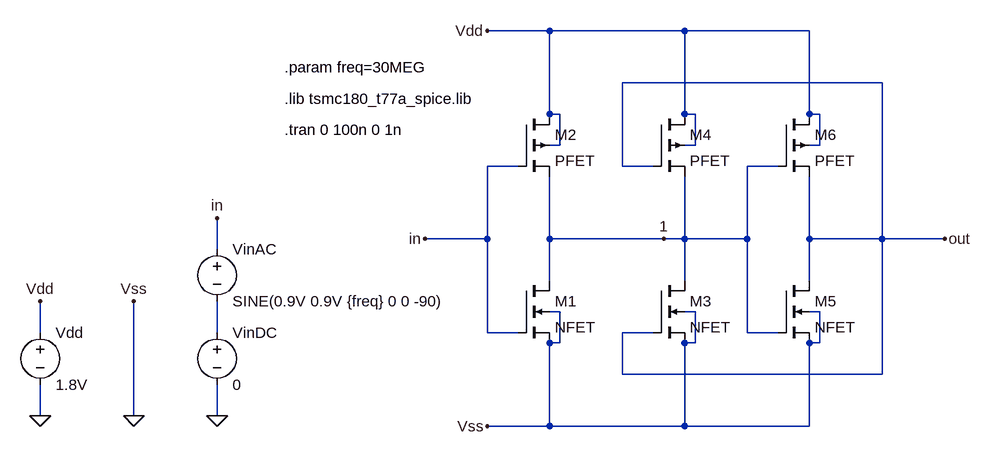
[diagram p0: schematic schmitt_trigger.asc]
schmitt_trigger.asc, the LTspice schematic file:
Version 4.1
SHEET 1 1160 680
WIRE 496 -272 400 -272
WIRE 704 -272 496 -272
WIRE 896 -272 704 -272
WIRE 1008 -192 608 -192
WIRE 496 -144 496 -272
WIRE 512 -144 496 -144
WIRE 704 -144 704 -272
WIRE 720 -144 704 -144
WIRE 896 -144 896 -272
WIRE 912 -144 896 -144
WIRE 512 -96 512 -144
WIRE 512 -96 496 -96
WIRE 720 -96 720 -144
WIRE 720 -96 704 -96
WIRE 912 -96 912 -144
WIRE 912 -96 896 -96
WIRE 448 -64 400 -64
WIRE 608 -64 608 -192
WIRE 656 -64 608 -64
WIRE 848 -64 800 -64
WIRE 400 48 400 -64
WIRE 400 48 304 48
WIRE 496 48 496 -48
WIRE 672 48 496 48
WIRE 704 48 704 -48
WIRE 704 48 672 48
WIRE 800 48 800 -64
WIRE 800 48 704 48
WIRE 896 48 896 -48
WIRE 1008 48 1008 -192
WIRE 1008 48 896 48
WIRE 1104 48 1008 48
WIRE -16 64 -16 16
WIRE 496 112 496 48
WIRE 704 112 704 48
WIRE 896 112 896 48
WIRE 512 160 496 160
WIRE 720 160 704 160
WIRE 912 160 896 160
WIRE -288 192 -288 144
WIRE -16 192 -16 144
WIRE 400 192 400 48
WIRE 448 192 400 192
WIRE 656 192 608 192
WIRE 800 192 800 48
WIRE 848 192 800 192
WIRE 512 208 512 160
WIRE 512 208 496 208
WIRE 720 208 720 160
WIRE 720 208 704 208
WIRE 912 208 912 160
WIRE 912 208 896 208
WIRE 608 256 608 192
WIRE 1008 256 1008 48
WIRE 1008 256 608 256
WIRE -288 320 -288 272
WIRE -144 320 -144 144
WIRE -16 320 -16 272
WIRE 496 336 496 208
WIRE 496 336 400 336
WIRE 704 336 704 208
WIRE 704 336 496 336
WIRE 896 336 896 208
WIRE 896 336 704 336
FLAG 304 48 in
FLAG 1104 48 out
FLAG 400 336 Vss
FLAG 400 -272 Vdd
FLAG -288 320 0
FLAG -288 144 Vdd
FLAG -144 320 0
FLAG -144 144 Vss
FLAG -16 320 0
FLAG -16 16 in
FLAG 672 48 1
SYMBOL nmos4 448 112 R0
SYMATTR InstName M1
SYMATTR Value NFET
SYMATTR Value2 l=.2u w=2u
SYMBOL nmos4 656 112 R0
SYMATTR InstName M3
SYMATTR Value NFET
SYMATTR Value2 l=.2u w=.4u
SYMBOL nmos4 848 112 R0
SYMATTR InstName M5
SYMATTR Value NFET
SYMATTR Value2 l=.2u w=.4u
SYMBOL pmos4 448 -144 R0
SYMATTR InstName M2
SYMATTR Value PFET
SYMATTR Value2 l=.2u w=4u
SYMBOL pmos4 656 -144 R0
SYMATTR InstName M4
SYMATTR Value PFET
SYMATTR Value2 l=.2u w=.8u
SYMBOL pmos4 848 -144 R0
SYMATTR InstName M6
SYMATTR Value PFET
SYMATTR Value2 l=.2u w=.8u
SYMBOL voltage -288 176 R0
WINDOW 123 0 0 Left 0
WINDOW 39 0 0 Left 0
SYMATTR InstName Vdd
SYMATTR Value 1.8V
SYMBOL voltage -16 176 R0
WINDOW 123 0 0 Left 0
WINDOW 39 0 0 Left 0
SYMATTR InstName VinDC
SYMATTR Value 0
SYMBOL voltage -16 48 R0
WINDOW 123 0 0 Left 0
WINDOW 39 0 0 Left 0
SYMATTR InstName VinAC
SYMATTR Value SINE(0.9V 0.9V {freq} 0 0 -90)
TEXT 88 -168 Left 2 !.lib tsmc180_t77a_spice.lib
TEXT 88 -120 Left 2 !.tran 0 100n 0 1n
TEXT 88 -216 Left 2 !.param freq=30MEG

The netlist it stands for:
* schmitt_trigger.asc
M1 1 in 0 0 NFET l=.2u w=2u
M3 1 out 0 0 NFET l=.2u w=.4u
M5 out 1 0 0 NFET l=.2u w=.4u
M2 Vdd in 1 Vdd PFET l=.2u w=4u
M4 Vdd out 1 Vdd PFET l=.2u w=.8u
M6 Vdd 1 out Vdd PFET l=.2u w=.8u
Vdd Vdd 0 1.8V
VinDC N001 0 0
VinAC in N001 SINE(0.9V 0.9V {freq} 0 0 -90)
.model NMOS NMOS
.model PMOS PMOS
.lib standard.mos
.lib tsmc180_t77a_spice.lib
.tran 0 100n 0 1n
.param freq=30MEG
.backanno
.end